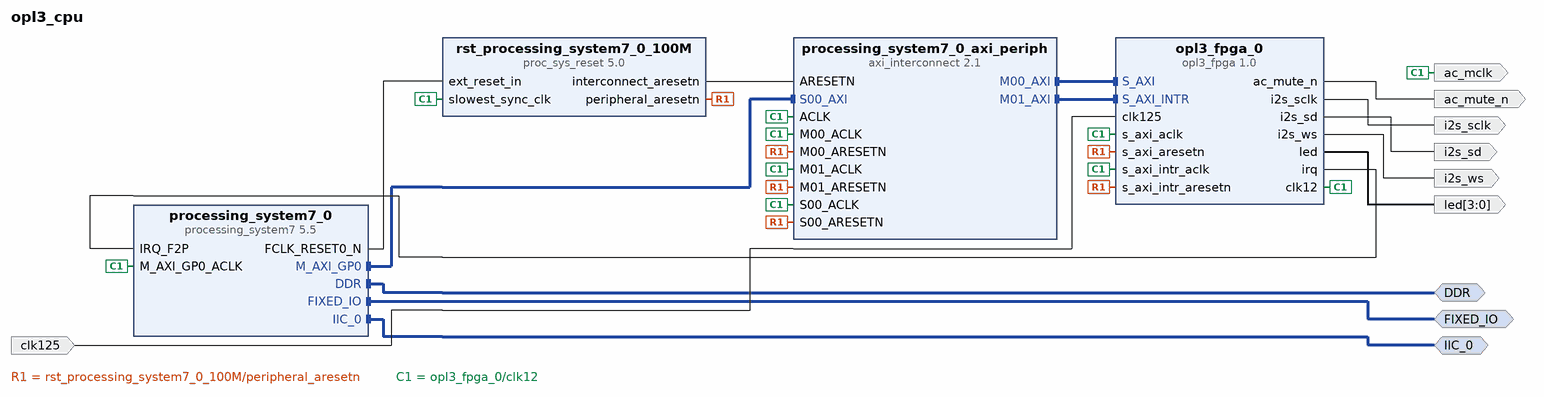
[diagram p0: block diagram of the top level]
# Vivado block design opl3_cpu, Vivado 2015.1
create_bd_design opl3_cpu

create_bd_intf_port -mode Master -vlnv xilinx.com:interface:ddrx_rtl:1.0 DDR
create_bd_intf_port -mode Master -vlnv xilinx.com:display_processing_system7:fixedio_rtl:1.0 FIXED_IO
create_bd_intf_port -mode Master -vlnv xilinx.com:interface:iic_rtl:1.0 IIC_0
create_bd_port -dir I -type clk clk125
set_property -dict {CONFIG.FREQ_HZ 125000000} [get_bd_ports clk125]
create_bd_port -dir O -type clk ac_mclk
create_bd_port -dir O i2s_ws
create_bd_port -dir O i2s_sd
create_bd_port -dir O ac_mute_n
create_bd_port -dir O -from 3 -to 0 led
create_bd_port -dir O i2s_sclk

create_bd_cell -type ip -vlnv xilinx.com:ip:processing_system7:5.5 processing_system7_0
set_property -dict [list \
  CONFIG.PCW_USE_FABRIC_INTERRUPT 1 \
  CONFIG.PCW_EN_CLK0_PORT 0 \
  CONFIG.PCW_IRQ_F2P_INTR 1 \
  CONFIG.PCW_IMPORT_BOARD_PRESET /media/sf_D_DRIVE/Users/Greg/git/opl3_fpga/fpga/top_level/board_def/ZYBO_zynq_def.xml \
] [get_bd_cells processing_system7_0]
create_bd_cell -type ip -vlnv xilinx.com:ip:axi_interconnect:2.1 processing_system7_0_axi_periph
set_property -dict {CONFIG.NUM_MI 2} [get_bd_cells processing_system7_0_axi_periph]
create_bd_cell -type ip -vlnv xilinx.com:ip:proc_sys_reset:5.0 rst_processing_system7_0_100M
create_bd_cell -type ip -vlnv gtaylormb:user:opl3_fpga:1.0 opl3_fpga_0

# ---- connections ----

connect_bd_intf_net [get_bd_intf_pins processing_system7_0/M_AXI_GP0] [get_bd_intf_pins processing_system7_0_axi_periph/S00_AXI]
connect_bd_intf_net [get_bd_intf_pins processing_system7_0_axi_periph/M00_AXI] [get_bd_intf_pins opl3_fpga_0/S_AXI]
connect_bd_intf_net [get_bd_intf_pins opl3_fpga_0/S_AXI_INTR] [get_bd_intf_pins processing_system7_0_axi_periph/M01_AXI]
connect_bd_intf_net [get_bd_intf_ports DDR] [get_bd_intf_pins processing_system7_0/DDR]
connect_bd_intf_net [get_bd_intf_ports FIXED_IO] [get_bd_intf_pins processing_system7_0/FIXED_IO]
connect_bd_intf_net [get_bd_intf_ports IIC_0] [get_bd_intf_pins processing_system7_0/IIC_0]
connect_bd_net [get_bd_pins processing_system7_0/FCLK_RESET0_N] [get_bd_pins rst_processing_system7_0_100M/ext_reset_in]
connect_bd_net [get_bd_pins rst_processing_system7_0_100M/peripheral_aresetn] \
  [get_bd_pins opl3_fpga_0/s_axi_aresetn] [get_bd_pins opl3_fpga_0/s_axi_intr_aresetn] \
  [get_bd_pins processing_system7_0_axi_periph/S00_ARESETN] [get_bd_pins processing_system7_0_axi_periph/M00_ARESETN] \
  [get_bd_pins processing_system7_0_axi_periph/M01_ARESETN]
connect_bd_net [get_bd_pins rst_processing_system7_0_100M/interconnect_aresetn] [get_bd_pins processing_system7_0_axi_periph/ARESETN]
connect_bd_net -net clk125_1 [get_bd_ports clk125] [get_bd_pins opl3_fpga_0/clk125]
connect_bd_net [get_bd_pins opl3_fpga_0/clk12] \
  [get_bd_ports ac_mclk] [get_bd_pins rst_processing_system7_0_100M/slowest_sync_clk] \
  [get_bd_pins processing_system7_0/M_AXI_GP0_ACLK] [get_bd_pins opl3_fpga_0/s_axi_aclk] \
  [get_bd_pins opl3_fpga_0/s_axi_intr_aclk] [get_bd_pins processing_system7_0_axi_periph/ACLK] \
  [get_bd_pins processing_system7_0_axi_periph/S00_ACLK] [get_bd_pins processing_system7_0_axi_periph/M00_ACLK] \
  [get_bd_pins processing_system7_0_axi_periph/M01_ACLK]
connect_bd_net [get_bd_pins opl3_fpga_0/i2s_ws] [get_bd_ports i2s_ws]
connect_bd_net [get_bd_pins opl3_fpga_0/i2s_sd] [get_bd_ports i2s_sd]
connect_bd_net [get_bd_pins opl3_fpga_0/ac_mute_n] [get_bd_ports ac_mute_n]
connect_bd_net [get_bd_pins opl3_fpga_0/led] [get_bd_ports led]
connect_bd_net [get_bd_pins opl3_fpga_0/i2s_sclk] [get_bd_ports i2s_sclk]
connect_bd_net [get_bd_pins opl3_fpga_0/irq] [get_bd_pins processing_system7_0/IRQ_F2P]

# ---- address map ----
assign_bd_address -offset 0x43C00000 -range 64K -target_address_space [get_bd_addr_spaces processing_system7_0/Data] [get_bd_addr_segs opl3_fpga_0/S_AXI/S_AXI_reg]
assign_bd_address -offset 0x43C10000 -range 64K -target_address_space [get_bd_addr_spaces processing_system7_0/Data] [get_bd_addr_segs opl3_fpga_0/S_AXI_INTR/S_AXI_INTR_reg]

validate_bd_design
save_bd_design
